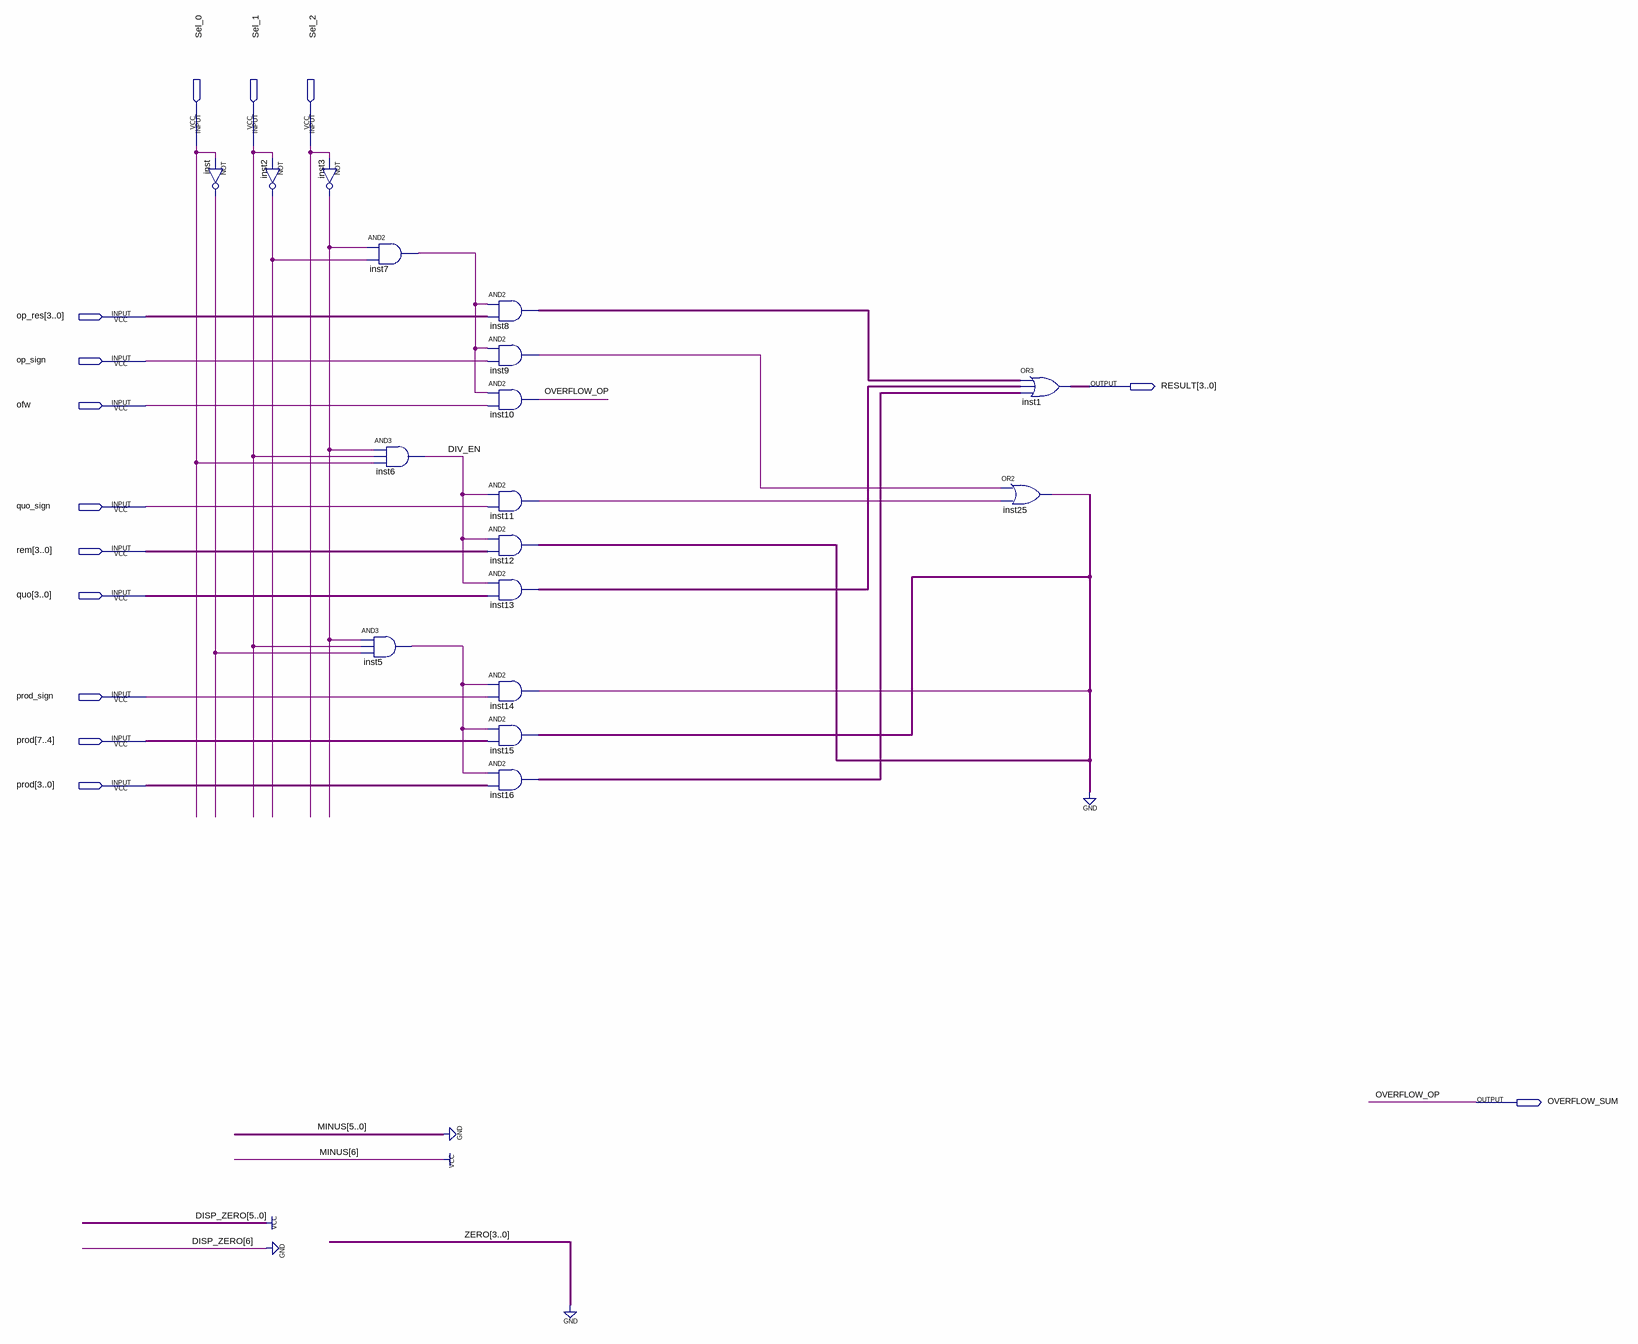
[diagram p0: schematic sheet]
// Quartus schematic mux_ula.bdf as structural Verilog: 17 symbols, 14 pins
module mux_ula (
  input  Sel_0,
  input  Sel_1,
  input  Sel_2,
  input  [3:0] op_res,
  input  op_sign,
  input  ofw,
  input  quo_sign,
  input  [3:0] rem,
  input  [3:0] quo,
  input  prod_sign,
  input  [7:0] prod,
  output [3:0] RESULT,
  output OVERFLOW_SUM
);

  wire DIV_EN, inst2_out, inst3_out, inst5_out, inst7_out, inst9_out, inst11_out, inst14_out, inst25_out,
       inst_out;
  wire [3:0] inst8_out, inst12_out, inst13_out, inst16_out;

  not inst (inst_out, Sel_0);
  not inst2 (inst2_out, Sel_1);
  not inst3 (inst3_out, Sel_2);
  and inst7 (inst7_out, inst3_out, inst2_out);
  and inst6 (DIV_EN, inst3_out, Sel_1, Sel_0);
  and inst5 (inst5_out, inst3_out, Sel_1, inst_out);
  assign inst8_out = {4{inst7_out}} & op_res;  // AND2 inst8, 4 bits wide
  and inst9 (inst9_out, inst7_out, op_sign);
  and inst10 (OVERFLOW_SUM, inst7_out, ofw);
  and inst11 (inst11_out, DIV_EN, quo_sign);
  assign inst12_out = {4{DIV_EN}} & rem;  // AND2 inst12, 4 bits wide
  assign inst13_out = {4{DIV_EN}} & quo;  // AND2 inst13, 4 bits wide
  and inst14 (inst14_out, inst5_out, prod_sign);
  assign inst12_out = {4{inst5_out}} & prod[7:4];  // AND2 inst15, 4 bits wide
  assign inst16_out = {4{inst5_out}} & prod[3:0];  // AND2 inst16, 4 bits wide
  assign RESULT = inst8_out | inst13_out | inst16_out;  // OR3 inst1, 4 bits wide
  or inst25 (inst25_out, inst9_out, inst11_out);
  // also tied to GND on the sheet: {inst12_out[0], inst12_out[1], inst12_out[2], inst12_out[3]}

  // Other names for the same wires on the sheet: OVERFLOW_OP = OVERFLOW_SUM
endmodule
